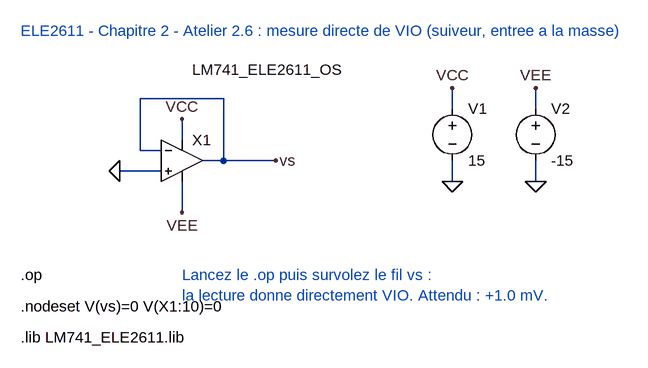
[diagram p0: schematic Ch2_Atelier_2_6_VIO.asc]
Ch2_Atelier_2_6_VIO.asc, the LTspice schematic file:
Version 4
SHEET 1 1200 700
WIRE 352 240 384 240
WIRE 384 144 384 240
WIRE 256 144 384 144
WIRE 256 144 256 224
WIRE 256 224 288 224
WIRE 320 176 320 208
WIRE 320 272 320 320
WIRE 384 240 464 240
WIRE 224 256 288 256
WIRE 736 128 736 160
WIRE 736 240 736 272
WIRE 864 128 864 160
WIRE 864 240 864 272
FLAG 320 176 VCC
FLAG 320 320 VEE
FLAG 464 240 vs
FLAG 224 256 0
FLAG 736 128 VCC
FLAG 736 272 0
FLAG 864 128 VEE
FLAG 864 272 0
SYMBOL Opamps\\opamp2 320 176 R0
WINDOW 3 16 -76 Left 2
SYMATTR InstName X1
SYMATTR Value LM741_ELE2611_OS
SYMBOL voltage 736 144 R0
SYMATTR InstName V1
SYMATTR Value 15
SYMBOL voltage 864 144 R0
SYMATTR InstName V2
SYMATTR Value -15
TEXT 72 40 Left 2 ;ELE2611 - Chapitre 2 - Atelier 2.6 : mesure directe de VIO (suiveur, entree a la masse)
TEXT 72 416 Left 2 !.op
TEXT 72 464 Left 2 !.nodeset V(vs)=0 V(X1:10)=0
TEXT 72 512 Left 2 !.lib LM741_ELE2611.lib
TEXT 320 416 Left 2 ;Lancez le .op puis survolez le fil vs :\nla lecture donne directement VIO. Attendu : +1.0 mV.

The netlist it stands for:
* Ch2_Atelier_2_6_VIO.asc
XX1 0 vs VCC VEE vs LM741_ELE2611_OS  ; pins In+ In- V+ V- OUT
V1 VCC 0 15
V2 VEE 0 -15
* ELE2611 - Chapitre 2 - Atelier 2.6 : mesure directe de VIO (suiveur, entree a la masse)
.op
.nodeset V(vs)=0 V(X1:10)=0
.lib LM741_ELE2611.lib
* Lancez le .op puis survolez le fil vs :
* la lecture donne directement VIO. Attendu : +1.0 mV.
.backanno
.end